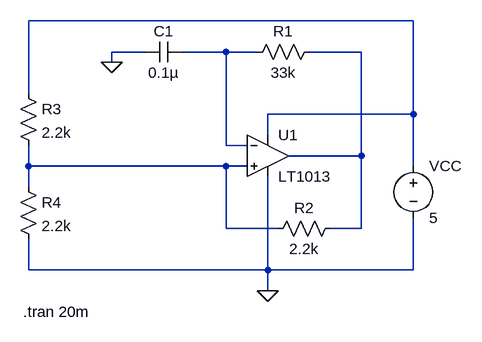
[diagram p0: schematic diff_sim.asc]
diff_sim.asc, the LTspice schematic file:
Version 4
SHEET 1 1064 680
WIRE 544 -32 -48 -32
WIRE 128 16 80 16
WIRE 256 16 192 16
WIRE 304 16 256 16
WIRE 464 16 384 16
WIRE 80 32 80 16
WIRE -48 80 -48 -32
WIRE 544 112 544 -32
WIRE 544 112 320 112
WIRE 320 144 320 112
WIRE 256 160 256 16
WIRE 288 160 256 160
WIRE 464 176 464 16
WIRE 464 176 352 176
WIRE -48 192 -48 160
WIRE 256 192 -48 192
WIRE 288 192 256 192
WIRE 544 192 544 112
WIRE -48 224 -48 192
WIRE 256 288 256 192
WIRE 336 288 256 288
WIRE 464 288 464 176
WIRE 464 288 416 288
WIRE -48 352 -48 304
WIRE 320 352 320 208
WIRE 320 352 -48 352
WIRE 544 352 544 272
WIRE 544 352 320 352
WIRE 320 384 320 352
FLAG 320 384 0
FLAG 80 32 0
SYMBOL voltage 544 176 R0
WINDOW 123 0 0 Left 2
WINDOW 39 0 0 Left 2
SYMATTR InstName VCC
SYMATTR Value 5
SYMBOL Opamps\\LT1013 320 112 R0
SYMATTR InstName U1
SYMBOL cap 192 0 R90
WINDOW 0 0 32 VBottom 2
WINDOW 3 32 32 VTop 2
SYMATTR InstName C1
SYMATTR Value 0.1µ
SYMBOL res 400 0 R90
WINDOW 0 0 56 VBottom 2
WINDOW 3 32 56 VTop 2
SYMATTR InstName R1
SYMATTR Value 33k
SYMBOL res 432 272 R90
WINDOW 0 0 56 VBottom 2
WINDOW 3 32 56 VTop 2
SYMATTR InstName R2
SYMATTR Value 2.2k
SYMBOL res -64 64 R0
SYMATTR InstName R3
SYMATTR Value 2.2k
SYMBOL res -64 208 R0
SYMATTR InstName R4
SYMATTR Value 2.2k
TEXT -56 416 Left 2 !.tran 20m

The netlist it stands for:
* diff_sim.asc
VCC N001 0 5
XU1 N004 N002 N001 0 N003 LT1013  ; pins In+ In- V+ V- OUT
C1 N002 0 0.1µ
R1 N003 N002 33k
R2 N003 N004 2.2k
R3 N001 N004 2.2k
R4 N004 0 2.2k
.tran 20m
.lib LTC.lib
.backanno
.end